# Altium schematic sheet P01_PMIC.SchDoc
size A
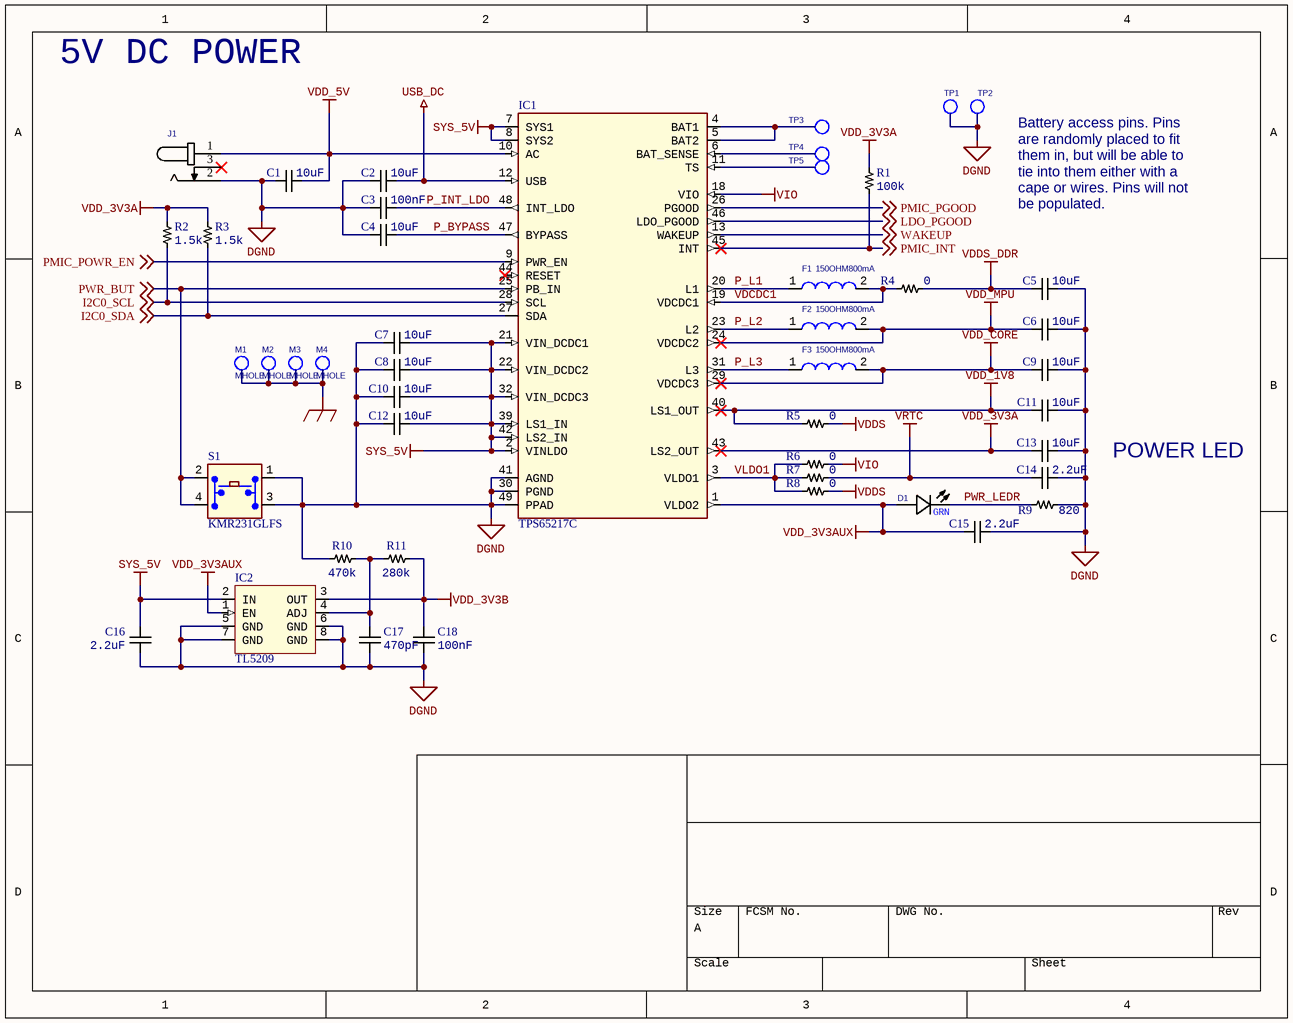
[diagram p0: P01_PMIC.SchDoc]

## Parts
C1  Capacitance: 10uF  [CAP0805]  (hidden comment: C2012X6S1A106K085AC)
C2  Capacitance: 10uF  [CAP0805]  (hidden comment: C2012X6S1A106K085AC)
C3  Capacitance: 100nF  [CAP0402]  (hidden comment: C0402C104K4RACTU)
C4  Capacitance: 10uF  [CAP0805]  (hidden comment: C2012X6S1A106K085AC)
C5  Capacitance: 10uF  [CAP0805]  (hidden comment: C2012X6S1A106K085AC)
C6  Capacitance: 10uF  [CAP0805]  (hidden comment: C2012X6S1A106K085AC)
C7  Capacitance: 10uF  [CAP0805]  (hidden comment: C2012X6S1A106K085AC)
C8  Capacitance: 10uF  [CAP0805]  (hidden comment: C2012X6S1A106K085AC)
C9  Capacitance: 10uF  [CAP0805]  (hidden comment: C2012X6S1A106K085AC)
C10  Capacitance: 10uF  [CAP0805]  (hidden comment: C2012X6S1A106K085AC)
C11  Capacitance: 10uF  [CAP0805]  (hidden comment: C2012X6S1A106K085AC)
C12  Capacitance: 10uF  [CAP0805]  (hidden comment: C2012X6S1A106K085AC)
C13  Capacitance: 10uF  [CAP0805]  (hidden comment: C2012X6S1A106K085AC)
C14  Capacitance: 2.2uF  [CAP0402]  (hidden comment: C1005X5R0J225K050BC)
C15  Capacitance: 2.2uF  [CAP0402]  (hidden comment: C1005X5R0J225K050BC)
C16  Capacitance: 2.2uF  [CAP0402]  (hidden comment: C1005X5R0J225K050BC)
C17  Capacitance: 470pF  [CAP0402]  (hidden comment: GRM155R71H471KA01D)
C18  Capacitance: 100nF  [CAP0402]  (hidden comment: C0402C104K4RACTU)
D1  598-8170-107F  [LED_0603]  (value not drawn)
F1  150OHM800mA  [FB0805]
F2  150OHM800mA  [FB0805]
F3  150OHM800mA  [FB0805]
IC1  TPS65217C  [PVQFN-48]
IC2  TL5209  [SOIC-8]
J1  PJ-200A  [CONN3-PWR-PJ102A]  (value not drawn)
M1  MHOLE  [MTGH200C125D_PL]  (no BOM)
M2  MHOLE  [MTGH200C125D_PL]  (no BOM)
M3  MHOLE  [MTGH200C125D_PL]  (no BOM)
M4  MHOLE  [MTGH200C125D_PL]  (no BOM)
R1  Resistance: 100k  [RES0402]  (hidden comment: RC0402FR-07100KL)
R2  Resistance: 1.5k  [RES0402]  (hidden comment: RC0402FR-071K5L)
R3  Resistance: 1.5k  [RES0402]  (hidden comment: RC0402FR-071K5L)
R4  Resistance: 0  [RES0402]  (hidden comment: RC0402JR-070RL)
R5  Resistance: 0  [RES0402]  (hidden comment: RC0402JR-070RL)
R6  Resistance: 0  [RES0402]  (hidden comment: RC0402JR-070RL)
R7  Resistance: 0  [RES0402]  (hidden comment: RC0402JR-070RL)
R8  Resistance: 0  [RES0402]  (hidden comment: RC0402JR-070RL)
R9  Resistance: 820  [RES0402]  (hidden comment: RC0402FR-07820RL)
R10  Resistance: 470k  [RES0402]  (hidden comment: RC0402FR-07470KL)
R11  Resistance: 280k  [RES0402]  (hidden comment: RC0402FR-07280KL)
S1  KMR231GLFS  [SW4SMD_63X161LS]
TP1  TESTPT1  [tp1-8040]  (value not drawn)  (no BOM)
TP2  TESTPT1  [tp1-8040]  (value not drawn)  (no BOM)
TP3  TESTPT1  [tp1-8040]  (value not drawn)  (no BOM)
TP4  TESTPT1  [tp1-8040]  (value not drawn)  (no BOM)
TP5  TESTPT1  [tp1-8040]  (value not drawn)  (no BOM)

## Nets
DGND: C1.2 C2.2 C3.2 C4.2 C5.1 C6.1 C7.2 C8.2 C9.1 C10.2 C11.1 C12.2 C13.1 C14.1 C15.1 C16.2 C17.2 C18.2 IC1.30(PGND) IC1.41(AGND) IC1.49(PPAD) IC2.5(GND) IC2.6(GND) IC2.7(GND) IC2.8(GND) J1.2 R9.2 R10.1 S1.1(A1) S1.3(A3) TP1.1(TP) TP2.1(TP)
GND_EARTH: M1.1(TP) M2.1(TP) M3.1(TP) M4.1(TP)
SYS_5V: C7.1 C8.1 C10.1 C12.1 C16.1 IC1.2(VINLDO) IC1.7(SYS1) IC1.8(SYS2) IC1.21(VIN_DCDC1) IC1.22(VIN_DCDC2) IC1.32(VIN_DCDC3) IC1.39(LS1_IN) IC1.42(LS2_IN) IC2.2(IN)
USB_DC: C2.1 IC1.12(USB)
VDD_1V8: C11.2 IC1.40(LS1_OUT) R5.1
VDD_3V3A: C13.2 IC1.43(LS2_OUT) R1.2 R2.2 R3.2
VDD_3V3AUX: C15.2 D1.2(A) IC1.1(VLDO2) IC2.1(EN)
VDD_3V3B: C18.1 IC2.3(OUT) R11.2
VDD_5V: C1.1 IC1.10(AC) J1.1
VDD_CORE: C9.2 F3.2 IC1.29(VDCDC3)
VDD_MPU: C6.2 F2.2 IC1.24(VDCDC2)
VDDS: R5.2 R8.2
VDDS_DDR: C5.2 R4.2
VIO: IC1.18(VIO) R6.2
VRTC: C14.2 R7.2
I2C0_SCL: IC1.28(SCL) R2.1 ; off-sheet I2C0_SCL
I2C0_SDA: IC1.27(SDA) R3.1 ; off-sheet I2C0_SDA
LDO_PGOOD: IC1.46(LDO_PGOOD) ; off-sheet LDO_PGOOD
P_BYPASS: C4.1 IC1.47(BYPASS)
P_INT_LDO: C3.1 IC1.48(INT_LDO)
P_L1: F1.1 IC1.20(L1)
P_L2: F2.1 IC1.23(L2)
P_L3: F3.1 IC1.31(L3)
PMIC_INT: IC1.45(INT) R1.1 ; off-sheet PMIC_INT
PMIC_PGOOD: IC1.26(PGOOD) ; off-sheet PMIC_PGOOD
PMIC_POWR_EN: IC1.9(PWR_EN) ; off-sheet PMIC_POWR_EN
PWR_BUT: IC1.25(PB_IN) S1.2(A2) S1.4 ; off-sheet PWR_BUT
PWR_LEDR: D1.1(C) R9.1
VDCDC1: F1.2 IC1.19(VDCDC1) R4.1
VLDO1: IC1.3(VLDO1) R6.1 R7.1 R8.1
WAKEUP: IC1.13(WAKEUP) ; off-sheet WAKEUP
NetC17_1: C17.1 IC2.4(ADJ) R10.2 R11.1
NetIC1_4: IC1.4(BAT1) IC1.5(BAT2) TP3.1(TP)
NetIC1_6: IC1.6(BAT_SENSE) TP4.1(TP)
NetIC1_11: IC1.11(TS) TP5.1(TP)

Not connected (* = marked no-connect by the designer): IC1 44(RESET)*; J1 3*

## Notes on the sheet
- 5V DC POWER
- (near TP2) Battery access pins. Pins are randomly placed to fit them in, but will be able to tie into them either with a cape or wires. Pins will not be populated.
- POWER LED
- (in symbol LED_LTST-C150GKT) GRN

## Library data of the parts
C1 C2 C4-C13 = CAP_10uF: MLCC 10uF 0805 SMD; Manufacturer: TDK; Dielectric Material: Ceramic; Tolerance: 10%; Voltage Rating: 10V; Dielectric: X6S; Supplier 1: Digi-Key; Manufacturer Part Number: C2012X6S1A106K085AC; Stock 1: 46852; Pricing 1: 1=0.30000, 10=0.20500, 100=0.11610, 500=0.08198, 1000=0.07173 (USD); RoHS: Yes; Mount: Surface Mount; Case/Package: 0805; Weight: 0.000194oz; Case Code (Metric): 2012; Case Code (Imperial): 0805; Min Operating Temperature: -55°C; Max Operating Temperature: 105°C; Packaging: Tape and Reel; Termination: SMD/SMT; Package Quantity: 4000; Voltage Rating (DC): 10V; Composition: Ceramic; Length: 2mm; Height: 1.25mm; Depth: 1.25mm; Width: 0.049inch; Thickness: 0.037inch; REACH SVHC: No SVHC; Lead Free: Lead Free; ComponentLink3URL: https://datasheet.ciiva.com/6290/tdkmlcccaprange-6290501.pdf?src-supplier=Digi-Key; ComponentLink3Description: Datasheet; Supplier Part Number 1: 445-7613-1-ND
C3 C18 = CAP_100nF: MLCC 100nF 0402 SMD; Manufacturer: KEMET; Tolerance: 10%; Voltage Rating (DC): 16V; Dielectric: X7R; Dissipation Factor: 3.5%; Supplier 1: Digi-Key; Manufacturer Part Number: C0402C104K4RACTU; Stock 1: 6512243; Pricing 1: 1=0.10000, 10=0.04200, 100=0.01860, 500=0.01328, 1000=0.01044, 2500=0.00949, 5000=0.00873 (USD); RoHS: Yes; Mount: Surface Mount; Case/Package: 0402; Case Code (Imperial): 0402; Case Code (Metric): 1005; Contact Plating: Tin,Matte; Min Operating Temperature: -55°C; Max Operating Temperature: 125°C; Packaging: Tape and Reel; Package Quantity: 10000; Voltage Rating: 16V; Termination: SMD/SMT; Length: 1mm; Height: 0.5mm; Width: 0.5mm; Depth: 0.5mm; Radiation Hardening: No; ComponentLink2URL: https://datasheet.ciiva.com/18192/getdatasheetpartid-385384-18192412.pdf?src-supplier=Verical; ComponentLink2Description: Datasheet; Supplier Part Number 1: 399-3521-1-ND
C14-C16 = CAP_2.2uF: MLCC 2.2uF 0402 SMD; Manufacturer: TDK; Dielectric Material: Ceramic; Tolerance: 10%; Dielectric: X5R; Voltage Rating: 6.3V; Supplier 1: Digi-Key; Manufacturer Part Number: C1005X5R0J225K050BC; Stock 1: 256055; Pricing 1: 1=0.20000, 10=0.13800, 100=0.07010, 500=0.04794, 1000=0.04240, 2500=0.04056, 5000=0.03687 (USD); RoHS: Yes; Mount: Surface Mount; Case/Package: 0402; Number of Pins: 2; Weight: 2.3E-05oz; Case Code (Metric): 1005; Case Code (Imperial): 0402; Min Operating Temperature: -55°C; Max Operating Temperature: 85°C; Packaging: Tape and Reel; Voltage Rating (DC): 6.3V; Termination: SMD/SMT; Package Quantity: 1; Composition: Ceramic; Voltage: 6.3V; Length: 1mm; Height: 0.5mm; Width: 0.02inch; Depth: 0.5mm; Thickness: 0.022inch; Radiation Hardening: No; Lead Free: Lead Free; REACH SVHC: No SVHC; ComponentLink7Description: Datasheet; ComponentLink7URL: https://product.tdk.com/info/en/catalog/datasheets/mlcc_commercial_general_en.pdf?ref_disty=digikey
C17 = CAP_470pF: MLCC 470pF 0402 SMD; Manufacturer: Murata; Material: Ceramic; Tolerance: 10%; Dielectric: X7R; Voltage Rating: 50V; Supplier 1: Digi-Key; Manufacturer Part Number: GRM155R71H471KA01D; Stock 1: 1824670; Pricing 1: 1=0.10000, 10=0.04900, 100=0.02200, 500=0.01572, 1000=0.01235, 2500=0.01122, 5000=0.01033 (USD); RoHS: Yes; Mount: Surface Mount; Case/Package: 0402; Number of Pins: 2; Case Code (Metric): 1005; Case Code (Imperial): 0402; Min Operating Temperature: -55°C; Max Operating Temperature: 125°C; Package Quantity: 1; Packaging: Tape and Reel; Voltage Rating (DC): 50V; Termination: SMD/SMT; Voltage: 50V; Length: 1mm; Height: 0.5mm; Width: 0.02inch; Thickness: 0.022inch; Depth: 0.5mm; Radiation Hardening: No; REACH SVHC: No SVHC; Lead Free: Lead Free; ComponentLink1URL: https://datasheet.ciiva.com/11786/0900766b80ef921d-11786912.pdf?src-supplier=RSComponents; ComponentLink1Description: https://datasheet.ciiva.com/11786/0900766b80ef921d-11786912.pdf?src-supplier=RSComponents; ComponentLink2URL: https://datasheet.ciiva.com/18101/getdatasheetpartid-37722-18101030.pdf?src-supplier=Verical; ComponentLink2Description: https://datasheet.ciiva.com/18101/getdatasheetpartid-37722-18101030.pdf?src-supplier=Verical; ComponentLink3URL: https://datasheet.ciiva.com/19476/1856505-19476137.pdf?src-supplier=Jameco; ComponentLink3Description: https://datasheet.ciiva.com/19476/1856505-19476137.pdf?src-supplier=Jameco; ComponentLink4URL: https://datasheet.ciiva.com/29199/454340-da-01-en-vs-kondensator-0402-29199656.pdf?src-supplier=Conrad; ComponentLink4Description: https://datasheet.ciiva.com/29199/454340-da-01-en-vs-kondensator-0402-29199656.pdf?src-supplier=Conrad; ComponentLink5URL: https://datasheet.ciiva.com/129/partnumbering-e-01-129843.pdf?src-supplier=Digi-Key; ComponentLink5Description: https://datasheet.ciiva.com/129/partnumbering-e-01-129843.pdf?src-supplier=Digi-Key; ComponentLink6URL: https://datasheet.ciiva.com/129/partnumbering-e-01-129844.pdf?src-supplier=Digi-Key; ComponentLink6Description: https://datasheet.ciiva.com/129/partnumbering-e-01-129844.pdf?src-supplier=Digi-Key; ComponentLink7URL: https://datasheet.ciiva.com/129/partnumbering-e-01-129845.pdf?src-supplier=Digi-Key; ComponentLink7Description: https://datasheet.ciiva.com/129/partnumbering-e-01-129845.pdf?src-supplier=Digi-Key; ComponentLink8URL: https://datasheet.ciiva.com/14116/grmseries-highdielectrictype-eng-14116837.pdf?src-supplier=Distrelec; ComponentLink8Description: https://datasheet.ciiva.com/14116/grmseries-highdielectrictype-eng-14116837.pdf?src-supplier=Distrelec; ComponentLink9URL: https://datasheet.ciiva.com/22698/608985-22698425.pdf?src-supplier=Element14; ComponentLink9Description: https://datasheet.ciiva.com/22698/608985-22698425.pdf?src-supplier=Element14; ComponentLink10URL: https://datasheet.ciiva.com/16199/product-16199180.pdf?src-supplier=Future+Electronics; ComponentLink10Description: https://datasheet.ciiva.com/16199/product-16199180.pdf?src-supplier=Future+Electronics; ComponentLink11URL: https://datasheet.ciiva.com/7937/608985-7937630.pdf?src-supplier=Element14; ComponentLink11Description: https://datasheet.ciiva.com/7937/608985-7937630.pdf?src-supplier=Element14; Supplier Part Number 1: 490-1300-1-ND
D1 = LED_LTST-C150GKT: LED GREEN CLEAR 0805 SMD; Manufacturer: Lite-On Inc; Manufacturer Part Number: LTST-C170KGKT; CLASS: DISCRETE; TN: 257-0020-000; Millicandela Rating: 35mcd; Voltage - Forward (Vf) Typ: 2V; Current - Test: 20mA; Wavelength - Dominant: 571nm; Wavelength - Peak: 574nm; Viewing Angle: 130°; Lens Style/Size: Rectangle with Flat Top, 1.4mm x 1.25mm; Supplier 1: Digi-Key; Supplier Part Number 1: 160-1414-6-ND; RoHS: RoHS Compliant; Category: Optoelectronics; Stock 1: 274890; Pricing 1: 1=0.37, 10=0.267, 100=0.1574, 250=0.11136, 500=0.09504, 1000=0.07425 (USD); Color: Green; Lens Type: Clear; Package / Case: 0805 (2012 Metric); Size / Dimension: 2.00mm L x 1.25mm W; Height: 1.10mm; Mounting Type: Surface Mount; Packaging: Digi-Reel®; Luminous Flux @ Current - Test: -; ComponentLink1URL: http://optoelectronics.liteon.com/en-us/api/DwonloadFileHandler.ashx?txtSpecNo=DS22-2000-073&txtPartNo=LTST-C170KGKT; ComponentLink1Description: http://optoelectronics.liteon.com/en-us/api/DwonloadFileHandler.ashx?txtSpecNo=DS22-2000-073&txtPartNo=LTST-C170KGKT
F1-F3 = IND: FERRITE 800MA 150 OHM 0805 SMD; Manufacturer: Laird-Signal Integrity Products; Manufacturer Part Number: LI0805H151R-10; DC Resistance (DCR): 150 mOhm Max; Impedance @ Frequency: 150 Ohm @ 100MHz; Filter Type: Differential Mode - Single; Supplier 1: Digi-Key; Supplier Part Number 1: 240-2384-6-ND; RoHS: RoHS Compliant; Category: Filters; Stock 1: 10144; Pricing 1: 1=0.1, 10=0.07, 25=0.064, 50=0.0574, 100=0.0421, 250=0.03064, 500=0.02808, 1000=0.02424 (USD); Current Rating: 800mA; Package / Case: 0805 (2012 Metric); Size / Dimension: 0.079" L x 0.049" W (2.00mm x 1.25mm); Mounting Type: Surface Mount; Packaging: Digi-Reel®; ComponentLink1URL: http://www.lairdtech.com/WorkArea/linkit.aspx?LinkIdentifier=id&ItemID=4912; ComponentLink1Description: http://www.lairdtech.com/WorkArea/linkit.aspx?LinkIdentifier=id&ItemID=4912; Height (Max): 0.043" (1.10mm)
IC1 = TPS65217C: IC PMIC BATT PWR SYST 48VQFN; Manufacturer: Texas Instruments; Manufacturer Part Number: TPS65217CRSLR; Voltage - Supply: 2.75 V ~ 5.8 V; Supplier 1: Digi-Key; Supplier Part Number 1: 296-34814-6-ND; RoHS: RoHS Compliant; Category: Integrated Circuits (ICs); Stock 1: 0; Pricing 1: 1=8.01, 10=7.204, 25=6.5516, 100=4.1918, 250=4.11412, 500=4.0365, 750=3.95888 (USD); Applications: Battery Management, Display (LED Drivers), Handheld/Mobile Devices, Power Supply; Current - Supply: -; Operating Temperature: -40°C ~ 105°C; Mounting Type: Surface Mount; Package / Case: 48-VFQFN Exposed Pad; Supplier Device Package: 48-VQFN-EP (6x6); Packaging: Digi-Reel®; ComponentLink1URL: http://www.ti.com/lit/ds/slvsb64i/slvsb64i.pdf; ComponentLink1Description: Datasheet
IC2 = TL5209: LDO Voltage Regulator; Manufacturer: Texas Instruments; Manufacturer Part Number: TL5209DR; Regulator Topology: Positive Adjustable; Voltage - Output: 2.5 V ~ 6.5 V; Voltage - Input: 2.5 V ~ 16 V; Voltage - Dropout (Typical): 0.35V @ 500mA; Number of Regulators: 1; Current - Output: 500mA (Max); Supplier 1: Digi-Key; Supplier Part Number 1: 296-21569-6-ND; RoHS: RoHS Compliant; Category: Integrated Circuits (ICs); Stock 1: 7190; Pricing 1: 1=1.41, 10=1.244, 25=1.1232, 100=0.9828, 250=0.86192, 500=0.7644, 1000=0.6045 (USD); Current - Limit (Min): -; Operating Temperature: -40°C ~ 125°C; Mounting Type: Surface Mount; Package / Case: 8-SOIC (0.154", 3.90mm Width); Supplier Device Package: 8-SOIC; Packaging: Digi-Reel®; ComponentLink1URL: http://media.digikey.com/pdf/Data%20Sheets/Texas%20Instruments%20PDFs/TL5209.pdf; ComponentLink1Description: http://media.digikey.com/pdf/Data%20Sheets/Texas%20Instruments%20PDFs/TL5209.pdf
J1 = Power_Jack: CONN PWR JACK 2.1X5.5MM HIGH CUR; Manufacturer: CUI Inc; Manufacturer Part Number: PJ-002AH; Gender: Male; Plug/Mating Plug Diameter: 2.1mm ID, 5.5mm OD; Number of Positions/Contacts: 2 Conductors, 3 Contacts; Internal Switch(s): Single Switch, Normally Closed; Shielding: Unshielded; Current Rating: 5A; Supplier 1: Digi-Key; Supplier Part Number 1: CP-002AH-ND; RoHS: RoHS Compliant; Category: Connectors, Interconnects; Stock 1: 81962; Pricing 1: 1=1.01, 10=0.704, 100=0.4724, 500=0.3819, 1000=0.3417, 2500=0.27135 (USD); Connector Type: Jack; Mounting Type: Through Hole, Right Angle; Termination: Solder Eyelet(s); Features: -; Color: Black; Contact Material: Copper Alloy; Contact Material - Plating: Nickel; Housing Color: Black; Housing Material: Thermoplastic; Operating Temperature: -25°C ~ 85°C; ComponentLink1URL: http://www.cui.com/Product/Resource/DigiKeyPDF/PJ-002AH.pdf; ComponentLink1Description: http://www.cui.com/Product/Resource/DigiKeyPDF/PJ-002AH.pdf
R1 = RES_100k: Resistor 100kOhm 0402 SMD; Manufacturer: Yageo; Tolerance: 1%; Temperature Coefficient: 100ppm/°C; Power Rating: 63mW; Voltage Rating: 50V; Manufacturer Part Number: RC0402FR-07100KL; RoHS: Yes; Case/Package: 0402; Case Code (Metric): 1005; Case Code (Imperial): 0402; Min Operating Temperature: -55°C; Max Operating Temperature: 155°C; Composition: Thick Film; Packaging: Tape and Reel; Package Quantity: 1; Number of Terminations: 2; Termination: SMD/SMT; Military Standard: Not; Max Power Dissipation: 63mW; Working Voltage: 50V; Features: Moisture Resistant; Length: 0.039inch; Height: 0.016inch; Width: 0.02inch; Depth: 0.5mm; REACH SVHC: No SVHC; Lead Free: Lead Free; ComponentLink2Description: Datasheet; ComponentLink2URL: https://www.yageo.com/upload/media/product/productsearch/datasheet/rchip/PYu-RC_Group_51_RoHS_L_10.pdf; Supplier 1: Mouser; Supplier 2: Digi-Key; Supplier Part Number 1: 603-RC0402FR-07100KL; Supplier Part Number 2: 311-100KLRCT-ND
R2 R3 = RES_1.5k: Resistor 1.5kOhm 0402 SMD; Manufacturer: Yageo; Power Rating: 62.5mW; Tolerance: 1%; Voltage Rating: 50V; Temperature Coefficient: 100ppm/°C; Max Power Dissipation: 63mW; Manufacturer Part Number: RC0402FR-071K5L; RoHS: Yes; Case/Package: 0402; Case Code (Metric): 1005; Case Code (Imperial): 0402; Min Operating Temperature: -55°C; Max Operating Temperature: 155°C; Composition: Thick Film; Package Quantity: 1; Packaging: Tape and Reel; Number of Terminations: 2; Termination: SMD/SMT; Military Standard: Not; Features: Moisture Resistant; Length: 1mm; Height: 0.016inch; Width: 0.02inch; Depth: 0.5mm; REACH SVHC: No SVHC; Lead Free: Lead Free; Supplier 1: Digi-Key; Supplier 2: Mouser; Supplier Part Number 1: 311-1.50KLRCT-ND; Supplier Part Number 2: 603-RC0402FR-071K5L; ComponentLink1Description: Datasheet; ComponentLink1URL: https://www.yageo.com/upload/media/product/productsearch/datasheet/rchip/PYu-RC_Group_51_RoHS_L_10.pdf
R4-R8 = RES_0: Resistor 0Ohm 0402 SMD; Manufacturer: Yageo; Power Rating: 62.5mW; Tolerance: 5%; Voltage Rating: 50V; Temperature Coefficient: 200ppm/°C; Max Power Dissipation: 63mW; Supplier 1: Digi-Key; Manufacturer Part Number: RC0402JR-070RL; Stock 1: 68160806; Pricing 1: 1=0.10000, 10=0.01300, 25=0.00920, 50=0.00700, 100=0.00510, 250=0.00392, 500=0.00312, 1000=0.00230, 5000=0.00165 (USD); RoHS: Yes; Case/Package: 0402; Contact Plating: Tin,Matte; Case Code (Metric): 1005; Case Code (Imperial): 0402; Min Operating Temperature: -55°C; Max Operating Temperature: 155°C; Composition: Thick Film; Packaging: Tape and Reel; Termination: SMD/SMT; Package Quantity: 1; Number of Terminations: 2; Military Standard: Not; Features: Moisture Resistant; Length: 1mm; Height: 0.016inch; Width: 0.02inch; Depth: 0.5mm; Radiation Hardening: No; Lead Free: Lead Free; REACH SVHC: Unknown; Supplier Part Number 1: 311-0.0JRCT-ND; ComponentLink1Description: Digikey; ComponentLink1URL: https://www.digikey.com/product-detail/en/yageo/RC0402JR-070RL/311-0.0JRCT-ND/729353; ComponentLink2Description: Datasheet; ComponentLink2URL: https://www.yageo.com/upload/media/product/productsearch/datasheet/rchip/PYu-RC_Group_51_RoHS_L_10.pdf
R9 = RES_820: Resistor 820Ohm 0402 SMD; Manufacturer: Yageo; Voltage Rating: 50V; Tolerance: 1%; Power Rating: 63mW; Temperature Coefficient: 100ppm/°C; Supplier 1: Digi-Key; Manufacturer Part Number: RC0402FR-07820RL; Stock 1: 1640857; Pricing 1: 1=0.10000, 10=0.01600, 100=0.00640, 1000=0.00289, 2500=0.00251, 5000=0.00207 (USD); RoHS: Yes; Case/Package: 0402; Case Code (Imperial): 0402; Case Code (Metric): 1005; Min Operating Temperature: -55°C; Max Operating Temperature: 155°C; Packaging: Tape and Reel; Package Quantity: 1; Termination: SMD/SMT; Composition: Thick Film; Number of Terminations: 2; Military Standard: Not; Max Power Dissipation: 63mW; Features: Moisture Resistant; Length: 1mm; Height: 0.016inch; Width: 0.5mm; Depth: 0.5mm; REACH SVHC: Unknown; Lead Free: Lead Free; Supplier Part Number 1: 311-820LRCT-ND
R10 = RES_470k: Resistor 470kOhm 0402 SMD; Manufacturer: Yageo; Tolerance: 1%; Power Rating: 62.5mW; Voltage Rating: 50V; Temperature Coefficient: 100ppm/°C; Max Power Dissipation: 63mW; Supplier 1: Digi-Key; Manufacturer Part Number: RC0402FR-07470KL; Stock 1: 2249859; Pricing 1: 1=0.10000, 10=0.01600, 100=0.00640, 1000=0.00289, 2500=0.00251, 5000=0.00207 (USD); RoHS: Yes; Case/Package: 0402; Number of Pins: 2; Case Code (Imperial): 0402; Case Code (Metric): 1005; Min Operating Temperature: -55°C; Max Operating Temperature: 155°C; Packaging: Tape and Reel; Voltage Rating (DC): 50V; Package Quantity: 1; Termination: SMD/SMT; Composition: Thick Film; Number of Terminations: 2; Military Standard: Not; Features: Moisture Resistant; Length: 1mm; Height: 0.016inch; Width: 0.02inch; Depth: 0.5mm; REACH SVHC: No SVHC; Lead Free: Lead Free; Supplier Part Number 1: 311-470KLRCT-ND; ComponentLink1Description: Datasheet; ComponentLink1URL: https://www.yageo.com/upload/media/product/productsearch/datasheet/rchip/PYu-RC_Group_51_RoHS_L_10.pdf
R11 = RES_280k: Resistor 280kOhm 0402 SMD; Manufacturer: Yageo; Tolerance: 1%; Temperature Coefficient: 100ppm/°C; Power Rating: 62.5mW; Voltage Rating: 50V; Max Power Dissipation: 63mW; Supplier 1: Digi-Key; ComponentLink1Description: Datasheet; ComponentLink1URL: https://www.yageo.com/upload/media/product/productsearch/datasheet/rchip/PYu-RC_Group_51_RoHS_L_10.pdf; Supplier Part Number 1: YAG3087CT-ND; Manufacturer Part Number: RC0402FR-07280KL; Stock 1: 1301983; Pricing 1: 1=0.10000, 10=0.01600, 100=0.00640, 1000=0.00289, 2500=0.00251, 5000=0.00207 (USD); RoHS: Yes; Case/Package: 0402; Contact Plating: Tin,Matte,Lead; Case Code (Imperial): 0402; Case Code (Metric): 1005; Min Operating Temperature: -55°C; Max Operating Temperature: 155°C; Composition: Thick Film; Packaging: Tape and Reel; Termination: SMD/SMT; Number of Terminations: 2; Military Standard: Not; Voltage Rating (DC): 50V; Features: Moisture Resistant; Length: 1mm; Height: 0.016inch; Width: 0.5mm; Depth: 0.5mm; Radiation Hardening: No; Lead Free: Lead Free
S1 = KMR2: Microminiature Tact Switch for SMT; Manufacturer: C&K Components; Circuit: SPST-NO; Switch Function: Off-Mom; Contact Rating @ Voltage: 0.05A @ 32VDC; Actuator Type: Standard; Actuator Height off PCB, from Pins: 1.90mm; Actuator Orientation: Top Actuated; Outline: 4.60mm x 2.80mm; Illumination: Non-Illuminated; Operating Force: 300gf; Switch Travel: 0.25mm; Mechanical Life: 150,000 Cycles; Supplier 1: Digi-Key; Supplier Part Number 1: 401-1429-6-ND; Manufacturer Part Number: KMR231GLFS; RoHS: RoHS Compliant; Category: Switches; Stock 1: 32289; Pricing 1: 1=0.44, 10=0.416, 25=0.3744, 50=0.3326, 100=0.3188, 250=0.29108, 500=0.2772, 1000=0.22869 (USD); Mounting Type: Surface Mount; Termination Style: Gull Wing; Illumination Voltage (Nominal): -; Illumination Type, Color: -; Ingress Protection: -; Features: Grounding Pin; Packaging: Digi-Reel®; Actuator Material: -; Operating Temperature: -40°C ~ 85°C; ComponentLink1URL: http://www.ck-components.com/index.php?module=media&action=Display&cmpref=14414&lang=en&width=&height=&format=&alt=; ComponentLink1Description: http://www.ck-components.com/index.php?module=media&action=Display&cmpref=14414&lang=en&width=&height=&format=&alt=